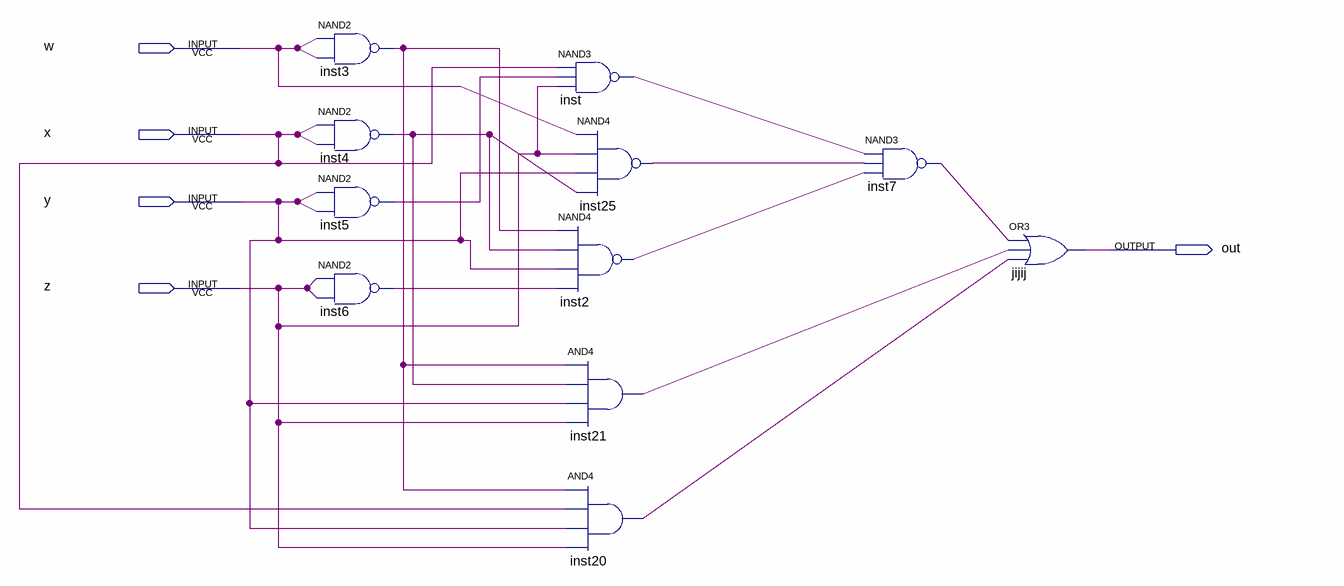
[diagram p0: schematic sheet]
// Quartus schematic Block1.bdf as structural Verilog: 11 symbols, 5 pins
module Block1 (
  input  w,
  input  x,
  input  y,
  input  z,
  output out
);

  wire inst2_out, inst3_out, inst4_out, inst5_out, inst6_out, inst7_out, inst20_out, inst21_out, inst25_out,
       inst_out;

  nand inst3 (inst3_out, w, w);
  nand inst4 (inst4_out, x, x);
  nand inst5 (inst5_out, y, y);
  nand inst6 (inst6_out, z, z);
  nand inst (inst_out, x, inst5_out, z);
  nand inst2 (inst2_out, inst3_out, inst4_out, y, inst6_out);
  and inst21 (inst21_out, inst3_out, inst4_out, y, z);
  and inst20 (inst20_out, inst3_out, x, y, z);
  nand inst25 (inst25_out, w, z, y, inst4_out);
  nand inst7 (inst7_out, inst_out, inst25_out, inst2_out);
  or jijij (out, inst7_out, inst21_out, inst20_out);
endmodule
